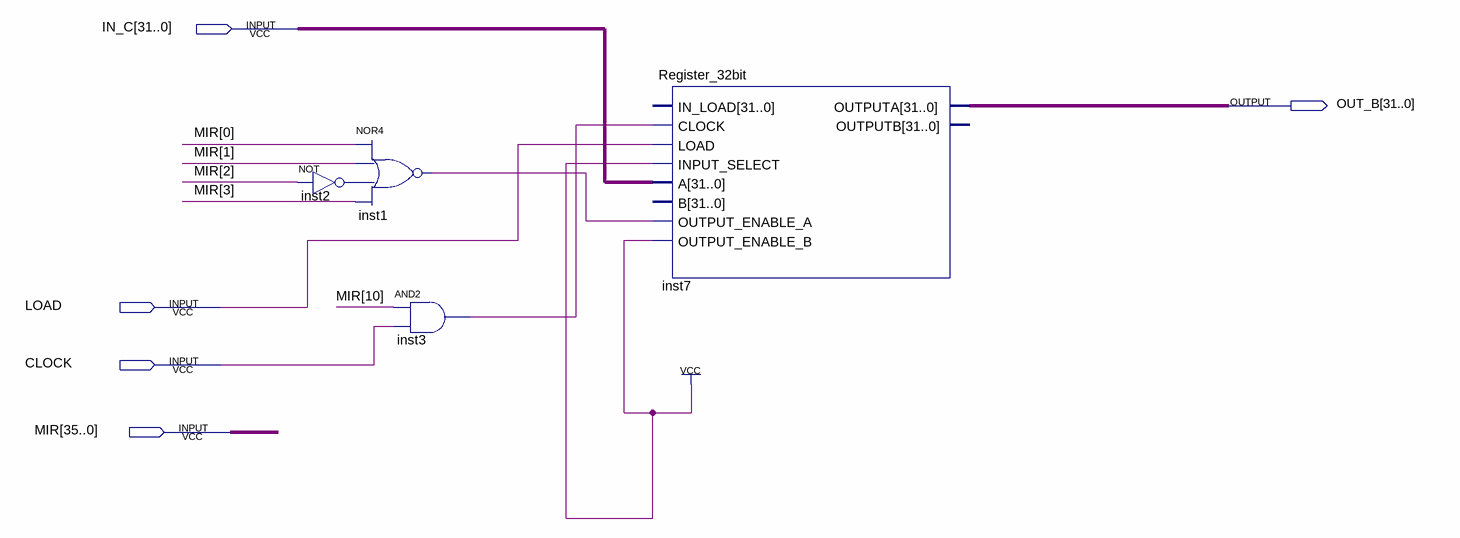
[diagram p0: schematic sheet]
// Quartus schematic SP.bdf as structural Verilog: 4 symbols, 5 pins
module SP (
  input  [31:0] IN_C,
  input  LOAD,
  input  CLOCK,
  input  [35:0] MIR,
  output [31:0] OUT_B
);

  wire inst1_out, inst2_out, inst3_out;

  not inst2 (inst2_out, MIR[2]);
  nor inst1 (inst1_out, MIR[0], MIR[1], inst2_out, MIR[3]);
  and inst3 (inst3_out, MIR[10], CLOCK);
  Register_32bit inst7 (
    .CLOCK(inst3_out), .LOAD(LOAD), .INPUT_SELECT(1'b1), .A(IN_C), .OUTPUT_ENABLE_A(inst1_out),
    .OUTPUT_ENABLE_B(1'b1), .OUTPUTA(OUT_B));  // open: IN_LOAD, B, OUTPUTB
endmodule
